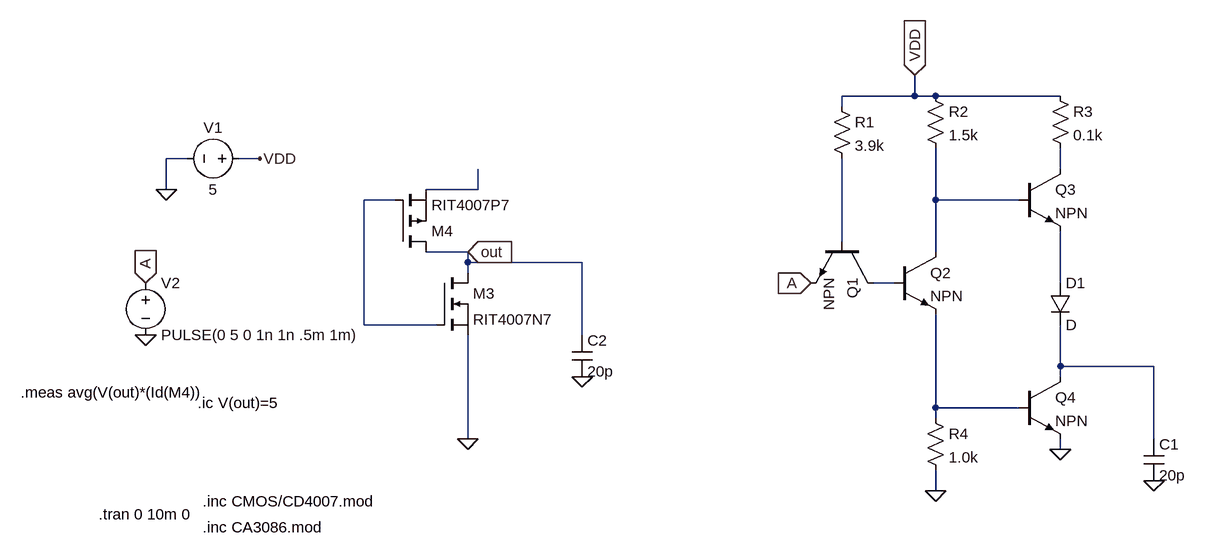
[diagram p0: schematic lab6.asc]
lab6.asc, the LTspice schematic file:
Version 4
SHEET 1 1624 680
WIRE 1200 -144 1200 -176
WIRE 1200 -144 1088 -144
WIRE 1232 -144 1200 -144
WIRE 1424 -144 1232 -144
WIRE 1088 -128 1088 -144
WIRE 80 -48 48 -48
WIRE 192 -48 160 -48
WIRE 1424 -32 1424 -64
WIRE 48 0 48 -48
WIRE 528 0 528 -32
WIRE 528 0 448 0
WIRE 400 16 352 16
WIRE 1232 16 1232 -64
WIRE 1360 16 1232 16
WIRE 1088 80 1088 -48
WIRE 512 96 448 96
WIRE 1232 96 1232 16
WIRE 512 112 512 96
WIRE 688 112 512 112
WIRE 512 128 512 112
WIRE 1168 144 1136 144
WIRE 1424 144 1424 64
WIRE 352 208 352 16
WIRE 464 208 352 208
WIRE 688 224 688 112
WIRE 1424 272 1424 208
WIRE 1568 272 1424 272
WIRE 1424 288 1424 272
WIRE 1232 336 1232 192
WIRE 1360 336 1232 336
WIRE 1232 352 1232 336
WIRE 512 384 512 224
WIRE 1568 384 1568 272
WIRE 1424 400 1424 384
WIRE 1232 464 1232 432
FLAG 48 0 0
FLAG 512 384 0
FLAG 192 -48 VDD
FLAG 16 144 A
IOPIN 16 144 In
FLAG 16 224 0
FLAG 512 96 out
IOPIN 512 96 In
FLAG 688 288 0
FLAG 1232 464 0
FLAG 1424 400 0
FLAG 1200 -176 VDD
IOPIN 1200 -176 In
FLAG 1568 448 0
FLAG 1040 144 A
IOPIN 1040 144 In
SYMBOL voltage 176 -48 R90
WINDOW 0 -32 56 VBottom 2
WINDOW 3 32 56 VTop 2
WINDOW 123 0 0 Left 2
WINDOW 39 0 0 Left 2
SYMATTR InstName V1
SYMATTR Value 5
SYMBOL nmos 464 128 R0
SYMATTR InstName M3
SYMATTR Value RIT4007N7
SYMBOL pmos 400 96 M180
SYMATTR InstName M4
SYMATTR Value RIT4007P7
SYMBOL voltage 16 128 R0
WINDOW 123 0 0 Left 2
WINDOW 39 0 0 Left 2
SYMATTR InstName V2
SYMATTR Value PULSE(0 5 0 1n 1n .5m 1m)
SYMBOL cap 672 224 R0
SYMATTR InstName C2
SYMATTR Value 20p
SYMBOL npn 1136 80 R90
SYMATTR InstName Q1
SYMBOL npn 1168 96 R0
SYMATTR InstName Q2
SYMBOL npn 1360 -32 R0
SYMATTR InstName Q3
SYMBOL npn 1360 288 R0
SYMATTR InstName Q4
SYMBOL diode 1408 144 R0
SYMATTR InstName D1
SYMBOL res 1072 -144 R0
SYMATTR InstName R1
SYMATTR Value 3.9k
SYMBOL res 1216 -160 R0
SYMATTR InstName R2
SYMATTR Value 1.5k
SYMBOL res 1408 -160 R0
SYMATTR InstName R3
SYMATTR Value 0.1k
SYMBOL res 1216 336 R0
SYMATTR InstName R4
SYMATTR Value 1.0k
SYMBOL cap 1552 384 R0
SYMATTR InstName C1
SYMATTR Value 20p
TEXT 104 480 Left 2 !.inc CMOS/CD4007.mod
TEXT -56 500 Left 2 !.tran 0 10m 0
TEXT 96 328 Left 2 !.ic V(out)=5
TEXT -176 312 Left 2 !.meas avg(V(out)*(Id(M4))
TEXT 104 520 Left 2 !.inc CA3086.mod

The netlist it stands for:
* lab6.asc
V1 VDD 0 5
M3 out N003 0 0 RIT4007N7
M4 out N003 N002 N002 RIT4007P7
V2 A 0 PULSE(0 5 0 1n 1n .5m 1m)
C2 out 0 20p
Q1 N006 N005 A 0 NPN
Q2 N004 N006 N009 0 NPN
Q3 N001 N004 N007 0 NPN
Q4 N008 N009 0 0 NPN
D1 N007 N008 D
R1 VDD N005 3.9k
R2 VDD N004 1.5k
R3 VDD N001 0.1k
R4 N009 0 1.0k
C1 N008 0 20p
.model D D
.lib standard.dio
.model NPN NPN
.model PNP PNP
.lib standard.bjt
.model NMOS NMOS
.model PMOS PMOS
.lib standard.mos
.inc CMOS/CD4007.mod
.tran 0 10m 0
.ic V(out)=5
.meas avg(V(out)*(Id(M4))
.inc CA3086.mod
.backanno
.end